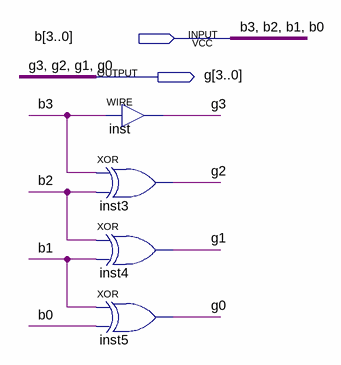
[diagram p0: schematic sheet]
// Quartus schematic s35_bin_to_gray.bdf as structural Verilog: 4 symbols, 2 pins
module s35_bin_to_gray (
  input  [3:0] b,
  output [3:0] g
);

  assign g[3] = b[3];  // WIRE inst
  xor inst3 (g[2], b[3], b[2]);
  xor inst4 (g[1], b[2], b[1]);
  xor inst5 (g[0], b[1], b[0]);
endmodule
